# Altium project Capstone_PLaque_PCB.PrjPcb
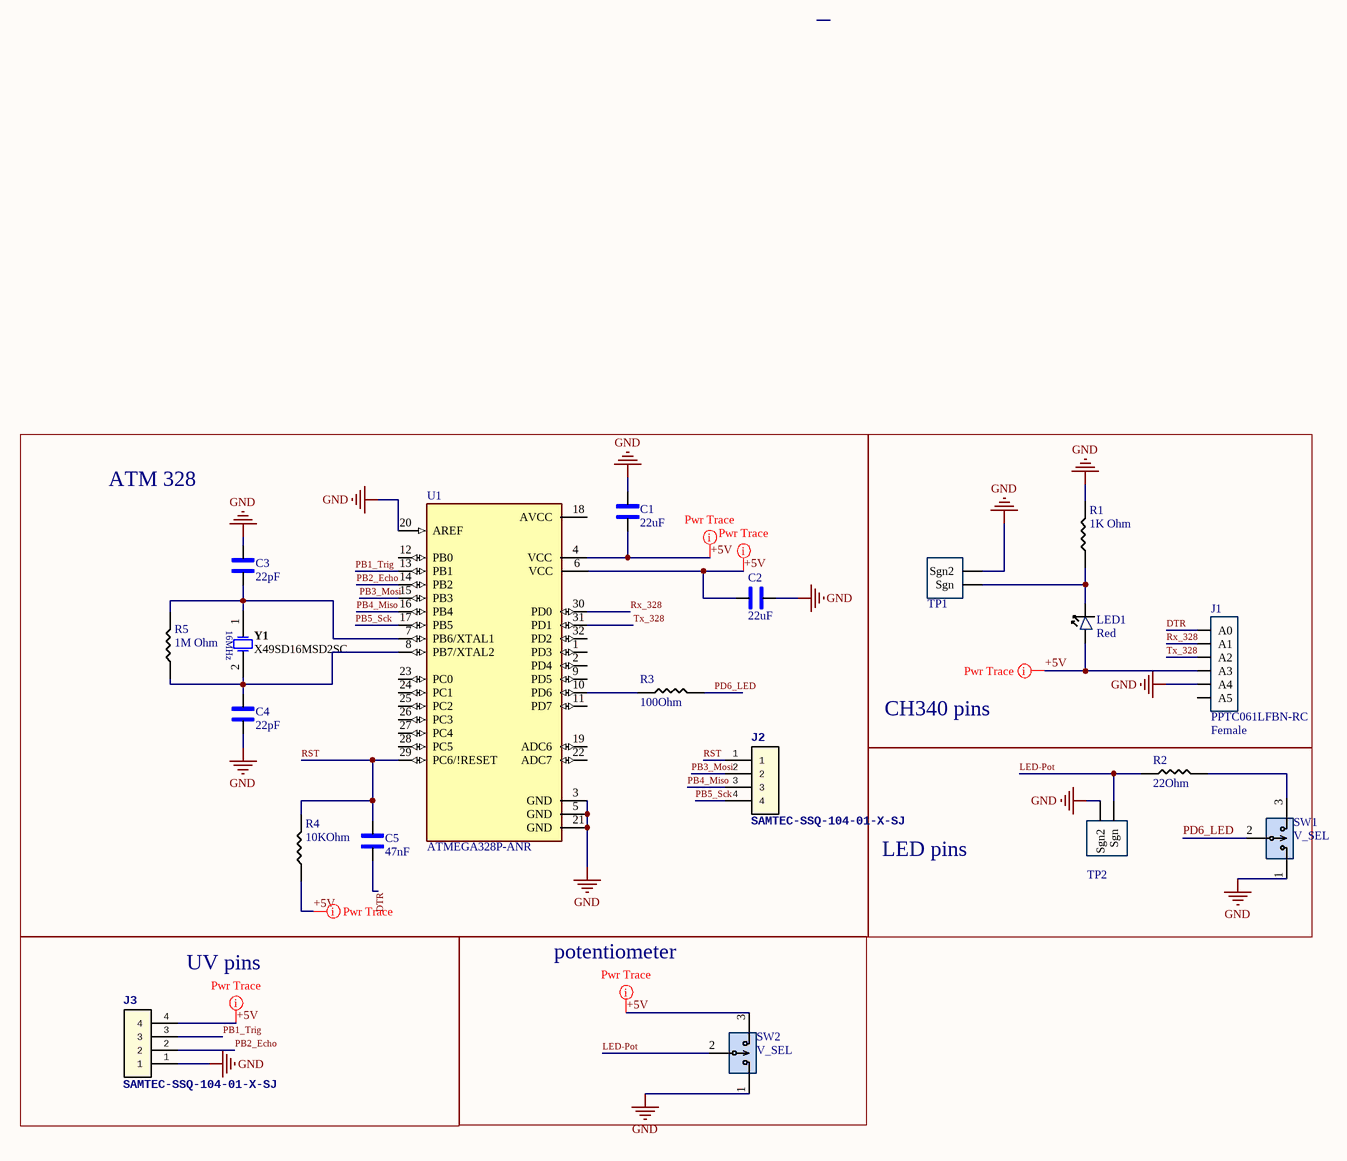
[diagram p0: Plaque_Layout.SchDoc]
1 sheet, 20 parts. Net scope: global (net labels, ports and power ports of the same name join across sheets).
Board file: Plaque_PCB.PcbDoc

## Sheet Plaque_Layout.SchDoc
size A3; SheetNumber: 1; SheetTotal: 1

### Parts
C1  22uF  [1206_Passive_Capacitor]
C2  22uF  [1206_Passive_Capacitor]
C3  22pF  [1206_Passive_Capacitor]
C4  22pF  [1206_Passive_Capacitor]
C5  47nF  [1206_Passive_Capacitor]
J1  PPTC061LFBN-RC  value Female  [6_PIN_ARD-Analog_100mil]
J2  SAMTEC-SSQ-104-01-X-SJ  [JF-4_SSQ-104-01-X-S]
J3  SAMTEC-SSQ-104-01-X-SJ  [JF-4_SSQ-104-01-X-S]
LED1  Red  [LED_1206]
R1  value 1K Ohm  [1206_Passive_Resitor]  (hidden comment: 1k)
R2  value 22Ohm  [1206_Passive_Resitor]  (hidden comment: 1 Ohm)
R3  100Ohm  [1206_Passive_Resitor]
R4  value 10KOhm  [1206_Passive_Resitor]  (hidden comment: 10k)
R5  value 1M Ohm  [1206_Passive_Resitor]  (hidden comment: 1M)
SW1  V_SEL  [3_PIN_100mil]
SW2  V_SEL  [3_PIN_100mil]
TP1  10x Probe TP  [TP_Diff_Probe]  (value not drawn)
TP2  10x Probe TP  [TP_Diff_Probe]  (value not drawn)
U1  ATMEGA328P-ANR  [ATMega328P]
Y1  X49SD16MSD2SC  [TH_CRYSTAL]

### Blocks framed on the sheet
ATM 328: C1-C5 J2 R3-R5 U1 Y1
CH340 pins: J1 LED1 R1 TP1
LED pins: R2 SW1 TP2
UV pins: J3
potentiometer: SW2

### Nets
GND: C1.2 C2.2 C3.2 C4.1 J1.5(A4) J3.1 R1.2 SW1.1 SW2.1 TP1.2(Sgn2) TP2.2(Sgn2) U1.3(GND) U1.5(GND) U1.20(AREF) U1.21(GND)
+5V: C1.1 C2.1 J1.4(A3) J3.4 LED1.1 R4.1 SW2.3 U1.4(VCC) U1.6(VCC)
DTR: C5.1 J1.1(A0)
LED-Pot: R2.1 SW2.2 TP2.1(Sgn)
PB1_Trig: J3.3 U1.13(PB1)
PB2_Echo: J3.2 U1.14(PB2)
PB3_Mosi: J2.2 U1.15(PB3)
PB4_Miso: J2.3 U1.16(PB4)
PB5_Sck: J2.4 U1.17(PB5)
PD6_LED: R3.2 SW1.2
RST: C5.2 J2.1 R4.2 U1.29(PC6/!RESET)
Rx_328: J1.2(A1) U1.30(PD0)
Tx_328: J1.3(A2) U1.31(PD1)
NetC3_1: C3.1 R5.2 U1.7(PB6/XTAL1) Y1.1
NetC4_2: C4.2 R5.1 U1.8(PB7/XTAL2) Y1.2
NetLED1_2: LED1.2 R1.1 TP1.1(Sgn)
NetR2_2: R2.2 SW1.3
NetR3_1: R3.1 U1.10(PD6)

Not connected (* = marked no-connect by the designer): J1 6(A5); U1 1(PD3) 2(PD4) 9(PD5) 11(PD7) 12(PB0) 18(AVCC) 19(ADC6) 22(ADC7) 23(PC0) 24(PC1) 25(PC2) 26(PC3) 27(PC4) 28(PC5) 32(PD2)

### Layout directives
rule Width Constraint [Pref Width = 20mil    Min Width = 10mil    Max Width = 100mil]: +5V

### Notes on the sheet
- (in symbol CRYSTAL_16MHZ_TH_1) 16MHz

### Library data of the parts
C1 C2 = C_22uF_1206: 22uF ±10% 25V X5R 1206 Multilayer Ceramic Capacitors MLCC - SMD/SMT RoHS; MFR Part #: CL31A226KAHNNNE; Type: basic; LCSC Part#: C12891; Datasheet: https://datasheet.lcsc.com/lcsc/1811031514_Samsung-Electro-Mechanics-CL31A226KAHNNNE_C12891.pdf; Value: 22uF
C3 C4 = C_22pF_1206: 50V 22pF C0G ±5% 1206 Multilayer Ceramic Capacitors MLCC - SMD/SMT ROHS; MFR Part #: CC1206JKNPOCBN220; Type: Extended; LCSC Part#: C107174; Datasheet: https://datasheet.lcsc.com/lcsc/1810241219_YAGEO-CC1206JKNPOCBN220_C107174.pdf; Value: 22pF
C5 = C_10nF_1206: 10nF 50V X7R ±10% 1206 Multilayer Ceramic Capacitors MLCC - SMD/SMT ROHS; MFR Part #: CL31B105KBHNNNE; Type: Basic; Digikey Link: https://www.digikey.com/product-detail/en/C1206C105M4RACTU/399-8150-1-ND/3471873/?itemSeq=304982366; LCSC Part#: C1848; Value: 47nF
J1 = JF_6_PIN_FEMA_ARD-Anolog: 6 Position Header Connector 0.100" (2.54mm) Through Hole Tin; Digikey Link: https://www.digikey.com/product-detail/en/PPTC061LFBN-RC/S7004-ND/810145/?itemSeq=304982353; MFR Part #: PPTC061LFBN-RC; LCSC Part#: C40877; Type: Extended
J2 J3 = JF_4_PIN_FEMALE: 2.54mm 3A bronze -40℃~+105℃ Straight 1x4P Top 4 1 Square Holes Straight,P=2.54mm  Female Headers ROHS; MFR PART #: SSQ-104-01-X-SJ; LCSC PART#: C2718488
LED1 = LED_RED_1206: Red 621~631nm 1206 Light Emitting Diodes (LED) RoHS; MFR Part #: 15-21/R6C-FQ1R1B/2T; Type: Extended; LCSC Part#: C93133; Datasheet: https://datasheet.lcsc.com/szlcsc/1811151241_Everlight-Elec-15-21-R6C-FQ1R1B-2T_C93133.pdf; Value: Red
R1 = R_1K_1206: CHIP RESISTOR - SURFACE MOUNT 1KOHMS ±1% 1/4W 1206 ROHS; MFR Part #: RNCP1206FTD1K00CT; Digikey Link: https://www.digikey.com/product-detail/en/RNCP1206FTD1K00/RNCP1206FTD1K00CT-ND/2240675/?itemSeq=304982373; LCSC Part#: C4410; Type: Basic
R2 = R_1_1206: 1Ω ±5% 0.25W ±400ppm/℃ 1206 Chip Resistor - Surface Mount RoHS; MFR Part #: 1206W4J010JT5E; LCSC Part#: C1409; Datasheet: https://datasheet.lcsc.com/lcsc/1810301410_UNI-ROYAL-Uniroyal-Elec-1206W4J010JT5E_C1409.pdf; Type: Extended
R3 = R_100_1206: 100Ω ±1% 0.25W ±100ppm/℃ 1206 Chip Resistor - Surface Mount RoHS; MFR Part #: 1206W4F1000T5E; LCSC Part#: C17901; Datasheet: https://datasheet.lcsc.com/lcsc/2206010145_UNI-ROYAL-Uniroyal-Elec-1206W4F1000T5E_C17901.pdf; Type: Basic; Value: 100Ohm
R4 = R_10K_1206: 10 kOhms ±5% 0.25W, 1/4W Chip Resistor 1206 (3216 Metric) Automotive AEC-Q200 Thick Film; MFR Part #: RMCF1206FT10K0; Digikey Link: https://www.digikey.com/en/products/detail/stackpole-electronics-inc/RMCF1206FT10K0/1759669; LCSC Part#: C17902; Type: Basic
R5 = R_1M_1206: CHIP RESISTOR - SURFACE MOUNT 1MOHMS ±1% 1/4W 1206 ROHS; MFR Part #: RMCF1206JT1M00; Digikey Link: https://www.digikey.com/product-detail/en/RMCF1206JT1M00/RMCF1206JT1M00CT-ND/1942830/?itemSeq=304982358; LCSC Part#: C17927; Type: Basic
SW1 SW2 = SW_3Pin_100mil_Switch: Connector Header Through Hole 3 position 0.100" (2.54mm); MFR Part #: PREC003SAAN-RC; Value: CONN HEADER VERT 3POS 2.54MM; Digikey Link: https://www.digikey.com/product-detail/en/PREC003SAAN-RC/S1012EC-03-ND/2774851/?itemSeq=304982371; Type: Extended; LCSC Part#: C49257
TP1 TP2 = TP_Diff_Probe: Test Point 300 mil centers
U1 = U_ATMega328P: AVR AVR® ATmega Microcontroller IC 8-Bit 20MHz 32KB (16K x 16) FLASH 32-TQFP (7x7); MFR Part #: ATMEGA328P-AU; Value: IC MCU 8BIT 32KB FLASH 32TQFP; Digikey Link: https://www.digikey.com/product-detail/en/ATMEGA328P-ANR/ATMEGA328P-ANRCT-ND/2774230/?itemSeq=304982365; LCSC Part#: C14877; Type: Basic
Y1 = CRYSTAL_16MHZ_TH_1: 16MHz Through Hole Crystal Oscillator (2-pin) 20pF ±20ppm ±30ppm HC-49S Crystals ROHS; ComponentLink1Description: LCSC Part; ComponentLink1URL: https://www.lcsc.com/product-detail/C16212.html; LCSC Part Number: C16212; Mfr. Part Number: X49SD16MSD2SC